# Altium project Elekid_Altium_Redo.PrjPcb
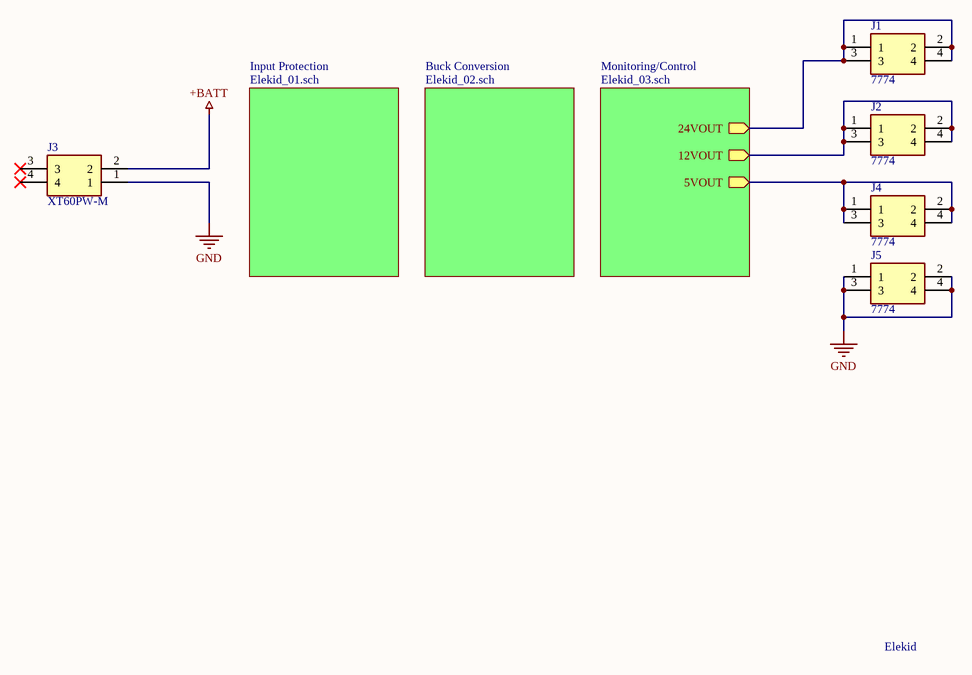
[diagram p0: Elekid.SchDoc]
5 sheets, 107 parts. Net scope: hierarchical (ports join the sheet entries above them; power ports are global).
Board file: Elekid.PcbDoc
Sheets:
  Elekid.SchDoc
  Elekid_01.SchDoc
  Elekid_02.SchDoc
  Elekid_03.SchDoc
    LED and LDO = Elekid_04.SchDoc

## Sheet Elekid.SchDoc
size A4

### Parts
J1  7774  [7774]
J2  7774  [7774]
J3  XT60PW-M  [XT60PWM]
J4  7774  [7774]
J5  7774  [7774]

### Sub-sheets
Buck Conversion = Elekid_02.sch (file not in this document): no entries
Input Protection = Elekid_01.sch (file not in this document): no entries
Monitoring/Control = Elekid_03.sch (file not in this document): 24VOUT (out), 12VOUT (out), 5VOUT (out)

### Nets
+BATT: J3.2
GND: J3.1 J5.1 J5.2 J5.3 J5.4
NetJ1_1: J1.1 J1.2 J1.3 J1.4 ; sheet Monitoring/Control/24VOUT
NetJ2_1: J2.1 J2.2 J2.3 J2.4 ; sheet Monitoring/Control/12VOUT
NetJ4_1: J4.1 J4.2 J4.3 J4.4 ; sheet Monitoring/Control/5VOUT

Not connected (* = marked no-connect by the designer): J3 3* 4*

### Notes on the sheet
- Elekid

### Library data of the parts
J1 J2 J4 J5 = 7774: Connector; Manufacturer_Name: Keystone Electronics; Datasheet Link: http://keyelco.com/userAssets/file/M65p66.pdf; Height: 4.6mm; Manufacturer_Part_Number: 7774; Arrow Part Number: 7774; Mouser Part Number: 534-7774; Mouser Price/Stock: https://www.mouser.co.uk/ProductDetail/Keystone-Electronics/7774?qs=%252B%252BPv0l39JAFc7pxogUYqRg%3D%3D
J3 = XT60PW-M: Connector; Manufacturer_Name: Changzou Amass Elec; Datasheet Link: https://www.tme.eu/Document/9b8d0c5eb7094295f3d3112c214d3ade/XT60PW%20SPEC.pdf; Height: 8.4mm; Manufacturer_Part_Number: XT60PW-M; Arrow Part Number: XT60PW-M

## Sheet Elekid_01.SchDoc
size A4
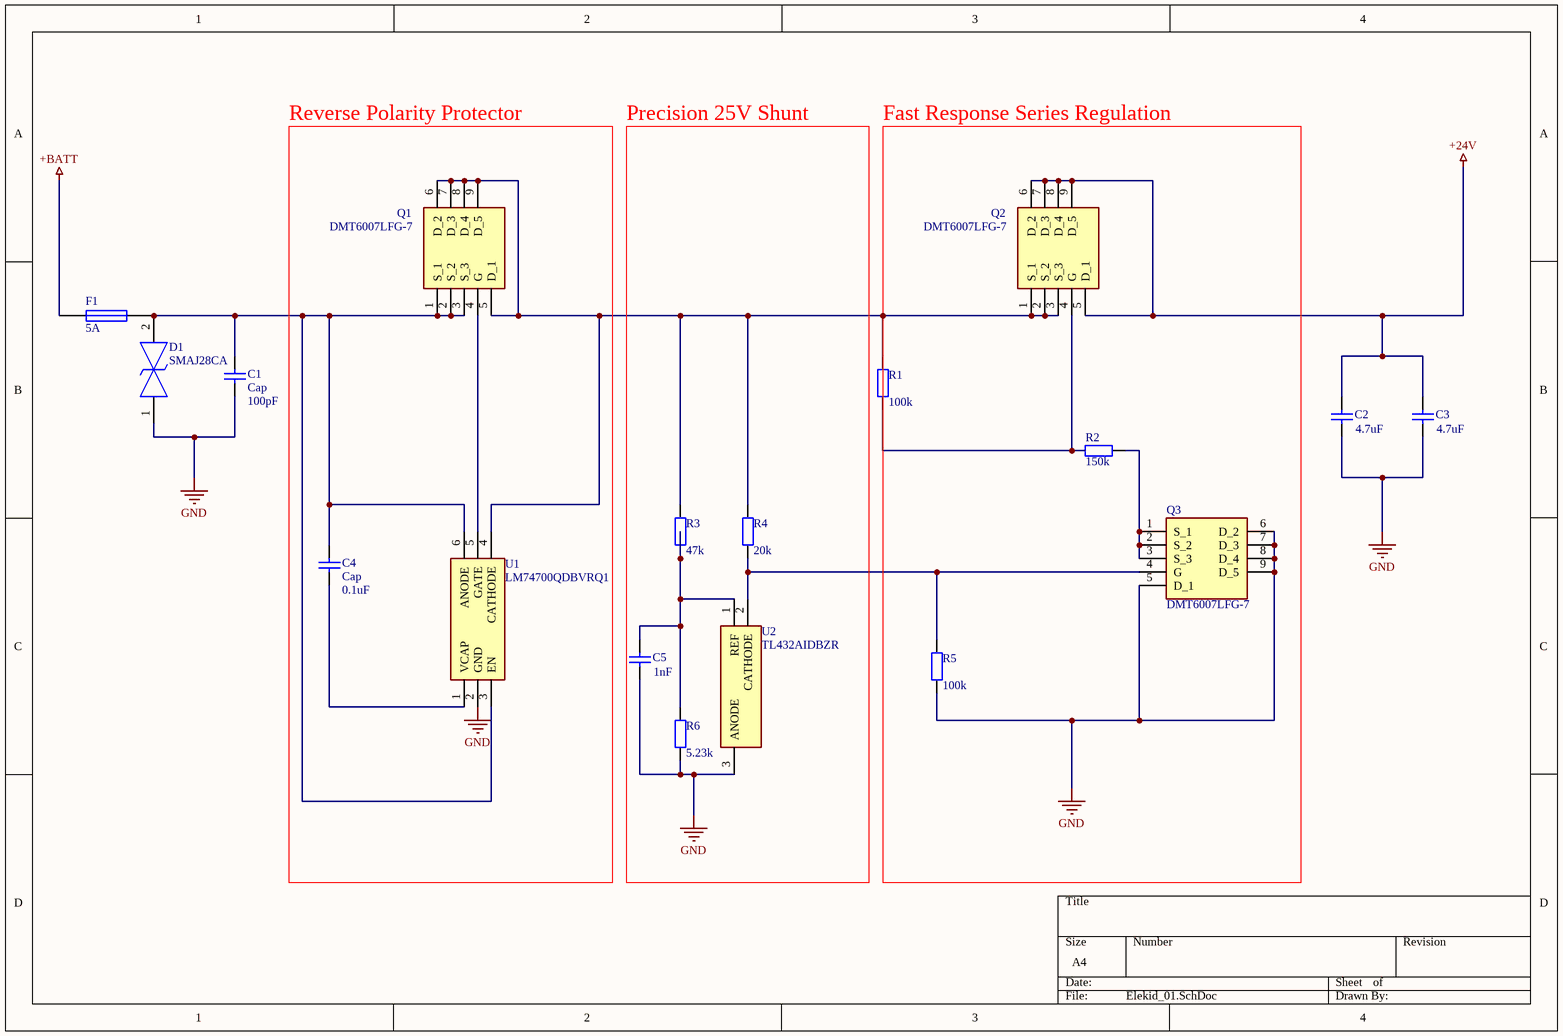
[diagram p1: Elekid_01.SchDoc]

### Parts
C1  Cap  value 100pF  [C0805]
C2  value 4.7uF  [C0805]  (hidden comment: Cap)
C3  value 4.7uF  [C0805]  (hidden comment: Cap)
C4  Cap  value 0.1uF  [C0805]
C5  value 1nF  [C0805]  (hidden comment: Cap)
D1  SMAJ28CA  [DIONM5226X262N]
F1  5A  [PIN-W2/E2.8]
Q1  DMT6007LFG-7  [DMT6007LFG7]
Q2  DMT6007LFG-7  [DMT6007LFG7]
Q3  DMT6007LFG-7  [DMT6007LFG7]
R1  value 100k  [C0805]  (hidden comment: Res2)
R2  value 150k  [C0805]  (hidden comment: Res2)
R3  value 47k  [C0805]  (hidden comment: Res2)
R4  value 20k  [C0805]  (hidden comment: Res2)
R5  value 100k  [C0805]  (hidden comment: Res2)
R6  value 5.23k  [C0805]  (hidden comment: Res2)
U1  LM74700QDBVRQ1  [SOT95P280X145-6N]
U2  TL432AIDBZR  [SOT95P237X112-3N]

### Blocks framed on the sheet
Reverse Polarity Protector: C4 Q1 U1
Precision 25V Shunt: C5 R3 R4 R6 U2
Fast Response Series Regulation: Q2 Q3 R1 R2 R5

### Nets
+24V: C2.2 C3.2 Q2.5(D_1) Q2.6(D_2) Q2.7(D_3) Q2.8(D_4) Q2.9(D_5)
+BATT: F1.1
GND: C1.1 C2.1 C3.1 C5.1 D1.1 Q3.5(D_1) Q3.6(D_2) Q3.7(D_3) Q3.8(D_4) Q3.9(D_5) R5.1 R6.1 U1.2(GND) U2.3(ANODE)
NetC1_2: C1.2 C4.2 D1.2 F1.2 Q1.1(S_1) Q1.2(S_2) Q1.3(S_3) U1.3(EN) U1.6(ANODE)
NetC4_1: C4.1 U1.1(VCAP)
NetC5_2: C5.2 R3.1 R6.2 U2.1(REF)
NetQ1_4: Q1.4(G) U1.5(GATE)
NetQ1_5: Q1.5(D_1) Q1.6(D_2) Q1.7(D_3) Q1.8(D_4) Q1.9(D_5) Q2.1(S_1) Q2.2(S_2) Q2.3(S_3) R1.2 R3.2 R4.2 U1.4(CATHODE)
NetQ2_4: Q2.4(G) R1.1 R2.2
NetQ3_1: Q3.1(S_1) Q3.2(S_2) Q3.3(S_3) R2.1
NetQ3_4: Q3.4(G) R4.1 R5.2 U2.2(CATHODE)

### Library data of the parts
C1-C5 = Cap: Capacitor; Published: 8-Jun-2000; LatestRevisionDate: 17-Jul-2002; LatestRevisionNote: Re-released for DXP Platform.; PackageReference: RAD-0.3; Publisher: Altium Limited; PackageDescription: Radial Cap, Thru-Hole; 2 Leads; 0.3 in Pin Spacing
D1 = SMAJ28CA: TVS Diode (Bi-directional); Manufacturer_Name: Bourns; Datasheet Link: https://www.bourns.com/data/global/pdfs/SMAJ.pdf; Height: 2.62mm; Manufacturer_Part_Number: SMAJ28CA; Arrow Part Number: SMAJ28CA; Arrow Price/Stock: https://www.arrow.com/en/products/smaj28ca/bourns; Mouser Part Number: 652-SMAJ28CA; Mouser Price/Stock: https://www.mouser.co.uk/ProductDetail/Bourns/SMAJ28CA?qs=A3H9pljuJ8Rc2FOBsYvsOw%3D%3D
F1 = Fuse 1: Fuse; Published: 8-Jun-2000; LatestRevisionDate: 17-Jul-2002; LatestRevisionNote: Re-released for DXP Platform.; PackageReference: PIN-W2/E2.8; Publisher: Altium Limited; PackageDescription: Thru-Hole; 2 Leads
Q1-Q3 = DMT6007LFG-7: MOSFET (N-Channel); Manufacturer_Name: Diodes Inc.; Datasheet Link: https://componentsearchengine.com/Datasheets/1/DMT6007LFG-7.pdf; Height: 0.85mm; Manufacturer_Part_Number: DMT6007LFG-7; Arrow Part Number: DMT6007LFG-7; Arrow Price/Stock: https://www.arrow.com/en/products/dmt6007lfg-7/diodes-incorporated; Mouser Part Number: 621-DMT6007LFG-7; Mouser Price/Stock: https://www.mouser.com/Search/Refine.aspx?Keyword=621-DMT6007LFG-7
R1-R6 = Res2: Resistor; Published: 8-Jun-2000; LatestRevisionDate: 17-Jul-2002; LatestRevisionNote: Re-released for DXP Platform.; PackageReference: AXIAL-0.4; Publisher: Altium Limited; PackageDescription: Axial Device, Thru-Hole; 2 Leads; 0.4 in Pin Spacing
U1 = LM74700QDBVRQ1: Integrated Circuit; Manufacturer_Name: Texas Instruments; Datasheet Link: http://www.ti.com/lit/gpn/LM74700-Q1; Height: 1.45mm; Manufacturer_Part_Number: LM74700QDBVRQ1; Arrow Part Number: LM74700QDBVRQ1; Arrow Price/Stock: https://www.arrow.com/en/products/lm74700qdbvrq1/texas-instruments; Mouser Part Number: 595-LM74700QDBVRQ1; Mouser Price/Stock: https://www.mouser.co.uk/ProductDetail/Texas-Instruments/LM74700QDBVRQ1?qs=j%252B1pi9TdxUYjAZhGV8eSkQ%3D%3D
U2 = TL432AIDBZR: Integrated Circuit; Manufacturer_Name: Texas Instruments; Datasheet Link: http://www.ti.com/lit/gpn/tl432a; Height: 1.12mm; Manufacturer_Part_Number: TL432AIDBZR; Arrow Part Number: TL432AIDBZR; Arrow Price/Stock: https://www.arrow.com/en/products/tl432aidbzr/texas-instruments; Mouser Part Number: 595-TL432AIDBZR; Mouser Price/Stock: https://www.mouser.co.uk/ProductDetail/Texas-Instruments/TL432AIDBZR?qs=odmYgEirbwzw%252BopYvrzCyA%3D%3D

## Sheet Elekid_02.SchDoc
size A4
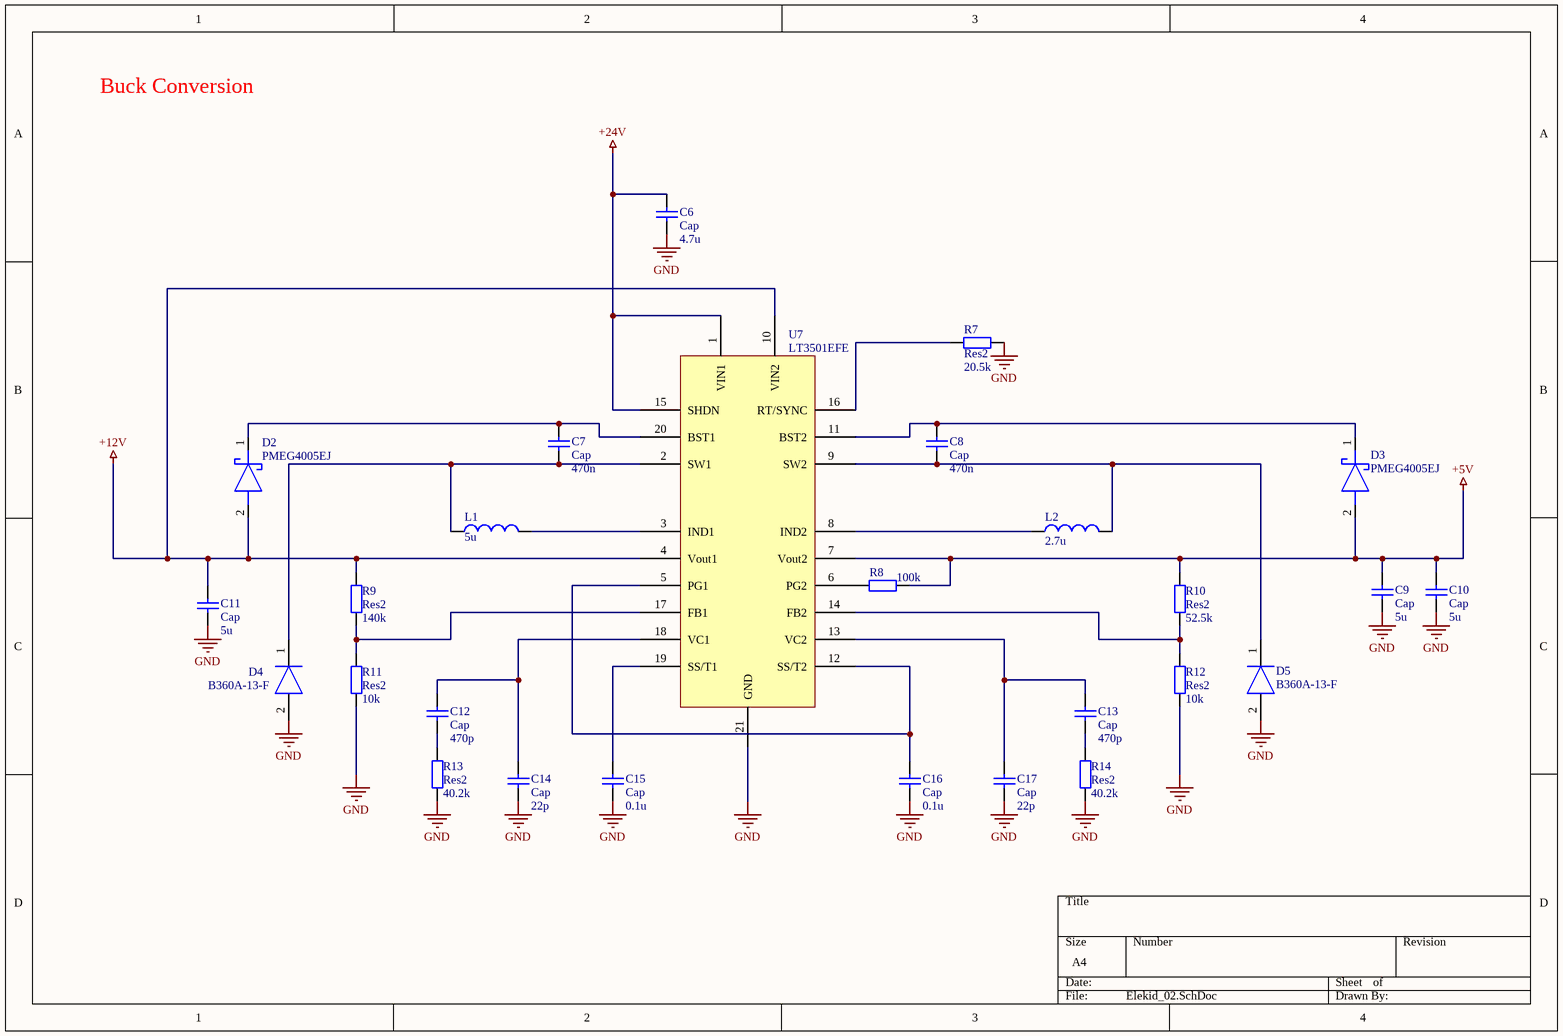
[diagram p2: Elekid_02.SchDoc]

### Parts
C6  Cap  value 4.7u  [C0805]
C7  Cap  value 470n  [C0805]
C8  Cap  value 470n  [C0805]
C9  Cap  value 5u  [C0805]
C10  Cap  value 5u  [C0805]
C11  Cap  value 5u  [C0805]
C12  Cap  value 470p  [C0805]
C13  Cap  value 470p  [C0805]
C14  Cap  value 22p  [C0805]
C15  Cap  value 0.1u  [C0805]
C16  Cap  value 0.1u  [C0805]
C17  Cap  value 22p  [C0805]
D2  PMEG4005EJ  [SOD2512X80N]
D3  PMEG4005EJ  [SOD2512X80N]
D4  B360A-13-F  [DIOM5226X240N]
D5  B360A-13-F  [DIOM5226X240N]
L1  value 5u  [c0805]  (hidden comment: Inductor)
L2  value 2.7u  [c0805]  (hidden comment: Inductor)
R7  Res2  value 20.5k  [C0805]
R8  value 100k  [C0805]  (hidden comment: Res2)
R9  Res2  value 140k  [C0805]
R10  Res2  value 52.5k  [C0805]
R11  Res2  value 10k  [C0805]
R12  Res2  value 10k  [C0805]
R13  Res2  value 40.2k  [C0805]
R14  Res2  value 40.2k  [C0805]
U7  LT3501EFE  [SOP65P640X120-21N]

### Nets
+5V: C9.2 C10.2 D3.2(A) R8.1 R10.2 U7.7(Vout2)
+12V: C11.2 D2.2(A) R9.2 U7.4(Vout1) U7.10(VIN2)
+24V: C6.2 U7.1(VIN1) U7.15(SHDN)
GND: C6.1 C9.1 C10.1 C11.1 C14.1 C15.1 C16.1 C17.1 D4.2(A) D5.2(A) R7.2 R11.1 R12.1 R13.1 R14.1 U7.21(GND)
NetC7_1: C7.1 D4.1(K) L1.1 U7.2(SW1)
NetC7_2: C7.2 D2.1(K) U7.20(BST1)
NetC8_1: C8.1 D5.1(K) L2.2 U7.9(SW2)
NetC8_2: C8.2 D3.1(K) U7.11(BST2)
NetC12_1: C12.1 R13.2
NetC12_2: C12.2 C14.2 U7.18(VC1)
NetC13_1: C13.1 R14.2
NetC13_2: C13.2 C17.2 U7.13(VC2)
NetC15_2: C15.2 U7.19(SS/T1)
NetC16_2: C16.2 U7.5(PG1) U7.12(SS/T2)
NetL1_2: L1.2 U7.3(IND1)
NetL2_1: L2.1 U7.8(IND2)
NetR7_1: R7.1 U7.16(RT/SYNC)
NetR8_2: R8.2 U7.6(PG2)
NetR9_1: R9.1 R11.2 U7.17(FB1)
NetR10_1: R10.1 R12.2 U7.14(FB2)

### Notes on the sheet
- Buck Conversion

### Library data of the parts
C6-C17 = Cap: Capacitor; Published: 8-Jun-2000; LatestRevisionDate: 17-Jul-2002; LatestRevisionNote: Re-released for DXP Platform.; PackageReference: RAD-0.3; Publisher: Altium Limited; PackageDescription: Radial Cap, Thru-Hole; 2 Leads; 0.3 in Pin Spacing
D2 D3 = PMEG4005EJ: Schottky Diode; Manufacturer_Name: Nexperia; Datasheet Link: http://www.nxp.com/documents/data_sheet/PMEGXX05EH_EJ_SER.pdf; Height: 0.8mm; Manufacturer_Part_Number: PMEG4005EJ; Arrow Part Number: PMEG4005EJ; Mouser Part Number: N/A; Mouser Price/Stock: https://www.mouser.com/Search/Refine.aspx?Keyword=N%2FA
D4 D5 = B360A-13-F: Diode; Manufacturer_Name: Diodes Inc.; Datasheet Link: https://www.diodes.com/assets/Datasheets/ds30891.pdf; Height: 2.4mm; Manufacturer_Part_Number: B360A-13-F; Arrow Part Number: B360A-13-F; Arrow Price/Stock: https://www.arrow.com/en/products/b360a-13-f/diodes-incorporated; Mouser Part Number: 621-B360A-F; Mouser Price/Stock: https://www.mouser.co.uk/ProductDetail/Diodes-Incorporated/B360A-13-F?qs=sVoUGXYOGv3xoCWNHVb4bA%3D%3D
L1 L2 = Inductor: Code_IEC: 1005; Published: 8-Jun-2000; LatestRevisionDate: 29-May-2009; LatestRevisionNote: IPC-7351 Footprint Added.; PackageReference: 0402-A; Publisher: Altium Limited; PackageDescription: Chip Inductor; Code_JEITA: 0402
R7-R14 = Res2: Resistor; Published: 8-Jun-2000; LatestRevisionDate: 17-Jul-2002; LatestRevisionNote: Re-released for DXP Platform.; PackageReference: AXIAL-0.4; Publisher: Altium Limited; PackageDescription: Axial Device, Thru-Hole; 2 Leads; 0.4 in Pin Spacing

## Sheet Elekid_03.SchDoc
size A4
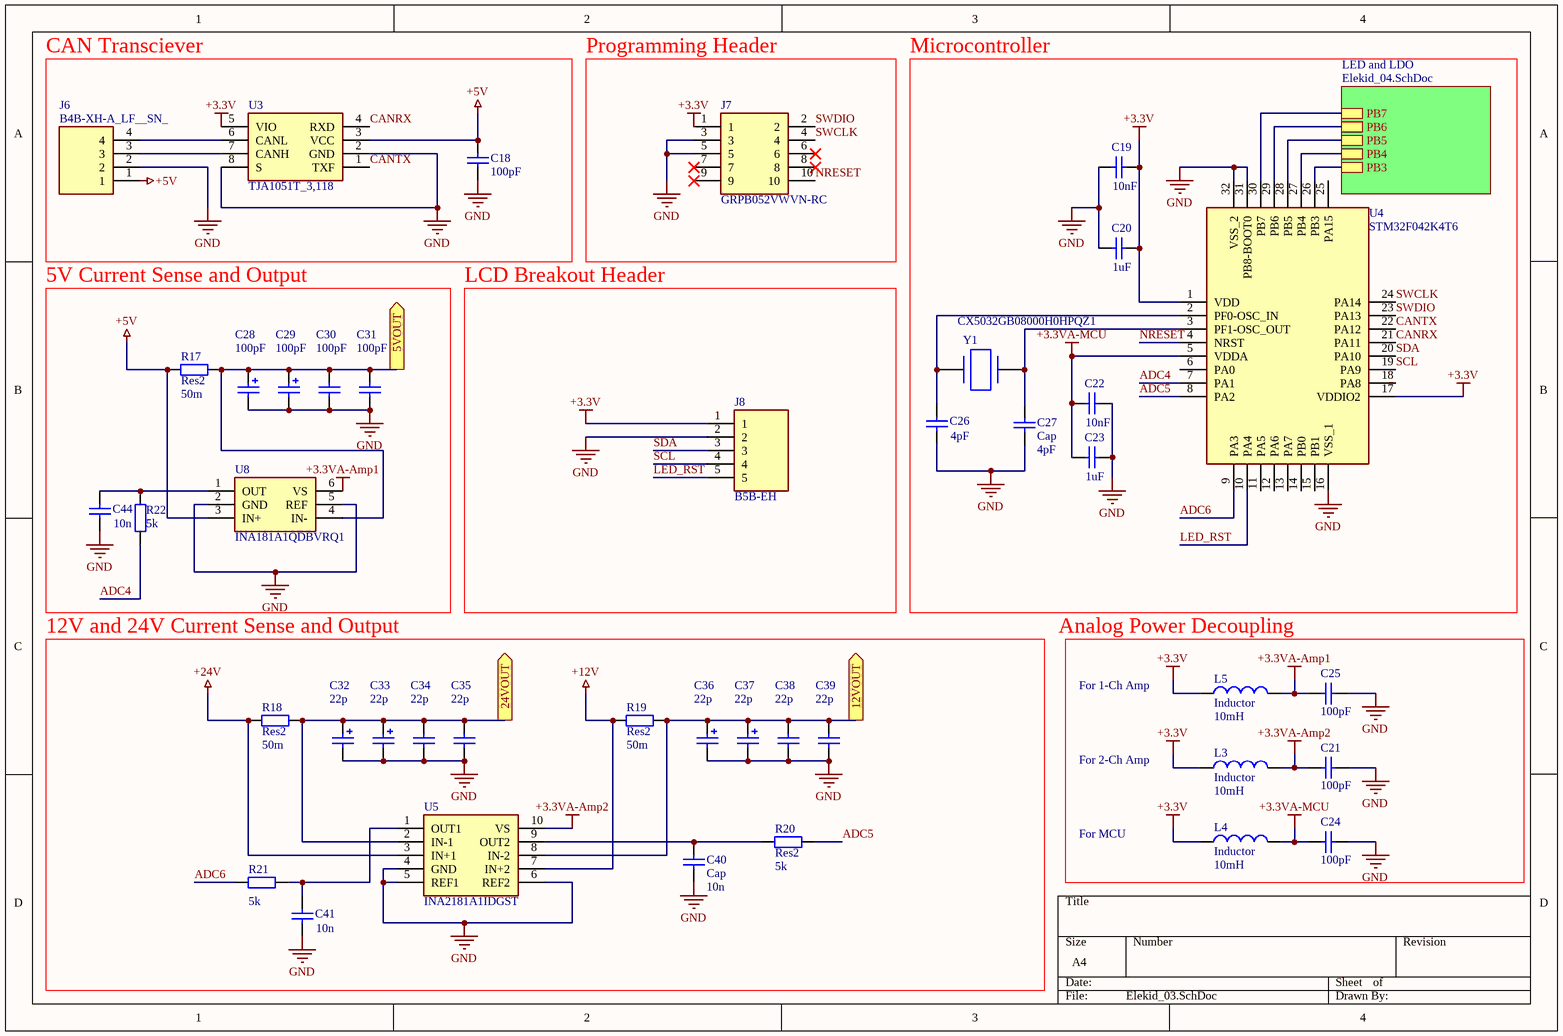
[diagram p3: Elekid_03.SchDoc]

### Parts
C18  value 100pF  [C0805]  (hidden comment: Cap)
C19  value 10nF  [C0805]  (hidden comment: Cap)
C20  value 1uF  [C0805]  (hidden comment: Cap)
C21  value 100pF  [C0805]  (hidden comment: Cap)
C22  value 10nF  [C0805]  (hidden comment: Cap)
C23  value 1uF  [C0805]  (hidden comment: Cap)
C24  value 100pF  [C0805]  (hidden comment: Cap)
C25  value 100pF  [C0805]  (hidden comment: Cap)
C26  value 4pF  [C0805]  (hidden comment: Cap)
C27  Cap  value 4pF  [C0805]
C28  value 100pF  [C0805]  (hidden comment: Cap Pol2)
C29  value 100pF  [C0805]  (hidden comment: Cap Pol2)
C30  value 100pF  [C0805]  (hidden comment: Cap)
C31  value 100pF  [C0805]  (hidden comment: Cap)
C32  value 22p  [C0805]  (hidden comment: Cap Pol2)
C33  value 22p  [C0805]  (hidden comment: Cap Pol2)
C34  value 22p  [C0805]  (hidden comment: Cap)
C35  value 22p  [C0805]  (hidden comment: Cap)
C36  value 22p  [C0805]  (hidden comment: Cap Pol2)
C37  value 22p  [C0805]  (hidden comment: Cap Pol2)
C38  value 22p  [C0805]  (hidden comment: Cap)
C39  value 22p  [C0805]  (hidden comment: Cap)
C40  Cap  value 10n  [C0805]
C41  value 10n  [C0805]  (hidden comment: Cap)
C44  value 10n  [C0805]  (hidden comment: Cap)
J6  B4B-XH-A_LF__SN_  [B4BXHALFSN]
J7  GRPB052VWVN-RC  [HDRV10W50P127_2X5_635X340X430P]
J8  B5B-EH  [SHDR5W64P0X250_1X5_1500X380X600P]
L3  Inductor  value 10mH  [c0805]
L4  Inductor  value 10mH  [c0805]
L5  Inductor  value 10mH  [c0805]
R17  Res2  value 50m  [C1206]
R18  Res2  value 50m  [C1206]
R19  Res2  value 50m  [C1206]
R20  Res2  value 5k  [C0805]
R21  value 5k  [C0805]  (hidden comment: Res2)
R22  value 5k  [C0805]  (hidden comment: Res2)
U3  TJA1051T_3,118  [SOIC127P600X175-8N]
U4  STM32F042K4T6  [QFP80P900X900X160-32N]
U5  INA2181A1IDGST  [SOP50P490X110-10N]
U8  INA181A1QDBVRQ1  [SOT95P280X145-6N]
Y1  CX5032GB08000H0HPQZ1  [CX5032GB08000H0HPQZ1]

### Blocks framed on the sheet
CAN Transciever: C18 J6 U3
Programming Header: J7
Microcontroller: C19 C20 C22 C23 C26 C27 U4 Y1
5V Current Sense and Output: C28-C31 C44 R17 R22 U8
LCD Breakout Header: J8
12V and 24V Current Sense and Output: C32-C41 R18-R21 U5

### Sub-sheets
LED and LDO = Elekid_04.SchDoc: PB7, PB6, PB5, PB4, PB3

### Ports
5VOUT (out), 12VOUT (out), 24VOUT (out)

### Nets
+3.3V: C19.1 C20.1 J7.1 J8.1 L3.1 L4.1 L5.1 U3.5(VIO) U4.1(VDD) U4.17(VDDIO2)
+3.3VA-Amp1: C25.1 L5.2 U8.6(VS)
+3.3VA-Amp2: C21.1 L3.2 U5.10(VS)
+3.3VA-MCU: C22.2 C23.2 C24.1 L4.2 U4.5(VDDA)
+5V: C18.2 J6.1 R17.1 U3.3(VCC) U8.3(IN+)
+12V: R19.1 U5.7(IN+2)
+24V: R18.1 U5.3(IN+1)
GND: C18.1 C19.2 C20.2 C21.2 C22.1 C23.1 C24.2 C25.2 C26.1 C27.1 C28.2 C29.2 C30.1 C31.1 C32.2 C33.2 C34.1 C35.1 C36.2 C37.2 C38.1 C39.1 C40.1 C41.1 C44.1 J6.2 J7.3 J7.5 J8.2 U3.2(GND) U3.8(S) U4.16(VSS_1) U4.31(PB8-BOOT0) U4.32(VSS_2) U5.4(GND) U5.5(REF1) U5.6(REF2) U8.2(GND) U8.5(REF)
ADC4: R22.1 U4.7(PA1)
ADC5: R20.2 U4.8(PA2)
ADC6: R21.1 U4.9(PA3)
CANRX: U3.4(RXD) U4.21(PA11)
CANTX: U3.1(TXF) U4.22(PA12)
LED_RST: J8.5 U4.10(PA4)
NRESET: J7.10 U4.4(NRST)
SCL: J8.4 U4.19(PA9)
SDA: J8.3 U4.20(PA10)
SWCLK: J7.4 U4.24(PA14)
SWDIO: J7.2 U4.23(PA13)
NetC26_2: C26.2 U4.2(PF0-OSC_IN) Y1.2
NetC27_2: C27.2 U4.3(PF1-OSC_OUT) Y1.1
NetC28_1: C28.1 C29.1 C30.2 C31.2 R17.2 U8.4(IN-) ; port 5VOUT
NetC32_1: C32.1 C33.1 C34.2 C35.2 R18.2 U5.2(IN-1) ; port 24VOUT
NetC36_1: C36.1 C37.1 C38.2 C39.2 R19.2 U5.8(IN-2) ; port 12VOUT
NetC40_2: C40.2 R20.1 U5.9(OUT2)
NetC41_2: C41.2 R21.2 U5.1(OUT1)
NetC44_2: C44.2 R22.2 U8.1(OUT)
NetD7_1: U4.30(PB7) ; sheet LED and LDO/PB7
NetD8_1: U4.29(PB6) ; sheet LED and LDO/PB6
NetD9_1: U4.28(PB5) ; sheet LED and LDO/PB5
NetD10_1: U4.27(PB4) ; sheet LED and LDO/PB4
NetD11_1: U4.26(PB3) ; sheet LED and LDO/PB3
NetJ6_3: J6.3 U3.7(CANH)
NetJ6_4: J6.4 U3.6(CANL)

Not connected (* = marked no-connect by the designer): J7 6* 7* 8* 9*; U4 6(PA0) 11(PA5) 12(PA6) 13(PA7) 14(PB0) 15(PB1) 18(PA8) 25(PA15)

### Notes on the sheet
- Analog Power Decoupling
- For 1-Ch Amp
- For 2-Ch Amp
- For MCU

### Library data of the parts
C18-C27 C30 C31 C34 C35 C38-C41 C44 = Cap: Capacitor; Published: 8-Jun-2000; LatestRevisionDate: 17-Jul-2002; LatestRevisionNote: Re-released for DXP Platform.; PackageReference: RAD-0.3; Publisher: Altium Limited; PackageDescription: Radial Cap, Thru-Hole; 2 Leads; 0.3 in Pin Spacing
C28 C29 C32 C33 C36 C37 = Cap Pol2: Polarized Capacitor (Axial); Published: 8-Jun-2000; LatestRevisionDate: 17-Jul-2002; LatestRevisionNote: Re-released for DXP Platform.; PackageReference: POLAR0.8; Publisher: Altium Limited; PackageDescription: Polarized Capacitor; 2 Leads
J6 = B4B-XH-A_LF__SN_: Connector; Manufacturer_Name: JST Sales America; Manufacturer_Part_Number: B4B-XH-A(LF)(SN); Datasheet Link: https://datasheet.lcsc.com/szlcsc/JST-Sales-America-B4B-XH-A-LF-SN_C144395.pdf; Height: 7mm; Arrow Part Number: B4B-XH-A(LF)(SN)
J7 = GRPB052VWVN-RC: Connector; Manufacturer_Name: Sullins; Datasheet Link: https://media.digikey.com/pdf/Data%20Sheets/Sullins%20PDFs/GRPB_%20_2VWVN-RC%2010954-C.pdf; Height: 4.3mm; Manufacturer_Part_Number: GRPB052VWVN-RC; Arrow Part Number: GRPB052VWVN-RC
J8 = B5B-EH: Connector; Manufacturer_Name: JST (JAPAN SOLDERLESS TERMINALS); Datasheet Link: http://www.jst-mfg.com/product/pdf/eng/eEH.pdf; Height: 6mm; Manufacturer_Part_Number: B5B-EH
L3-L5 = Inductor: Code_IEC: 1005; Published: 8-Jun-2000; LatestRevisionDate: 29-May-2009; LatestRevisionNote: IPC-7351 Footprint Added.; PackageReference: 0402-A; Publisher: Altium Limited; PackageDescription: Chip Inductor; Code_JEITA: 0402
R17-R22 = Res2: Resistor; Published: 8-Jun-2000; LatestRevisionDate: 17-Jul-2002; LatestRevisionNote: Re-released for DXP Platform.; PackageReference: AXIAL-0.4; Publisher: Altium Limited; PackageDescription: Axial Device, Thru-Hole; 2 Leads; 0.4 in Pin Spacing
U3 = TJA1051T_3,118: Integrated Circuit; Manufacturer_Name: NXP; Manufacturer_Part_Number: TJA1051T/3,118; Datasheet Link: http://www.nxp.com/docs/en/data-sheet/TJA1051.pdf; Height: 1.75mm; Arrow Part Number: TJA1051T/3,118; Arrow Price/Stock: https://www.arrow.com/en/products/tja1051t3118/nxp-semiconductors; Mouser Part Number: 771-TJA1051T3118; Mouser Price/Stock: https://www.mouser.co.uk/ProductDetail/NXP-Semiconductors/TJA1051T-3118?qs=O%2F7ihdSJpebv1PFlp05wnQ%3D%3D
U4 = STM32F042K4T6: Integrated Circuit; Manufacturer_Name: STMicroelectronics; Datasheet Link: https://www.mouser.com/datasheet/2/389/stm32f042c4-956225.pdf; Height: 1.6mm; Manufacturer_Part_Number: STM32F042K4T6; Arrow Part Number: STM32F042K4T6; Arrow Price/Stock: https://www.arrow.com/en/products/stm32f042k4t6/stmicroelectronics; Mouser Part Number: 511-STM32F042K4T6; Mouser Price/Stock: https://www.mouser.co.uk/ProductDetail/STMicroelectronics/STM32F042K4T6?qs=ClYTdQWm4hDAfZj5dd9NhA%3D%3D
U5 = INA2181A4IDGST: Integrated Circuit; Manufacturer_Name: Texas Instruments; Datasheet Link: http://www.ti.com/lit/ds/symlink/ina2181.pdf; Height: 1.1mm; Manufacturer_Part_Number: INA2181A4IDGST; Arrow Part Number: INA2181A4IDGST; Arrow Price/Stock: https://www.arrow.com/en/products/ina2181a4idgst/texas-instruments; Mouser Part Number: 595-INA2181A4IDGST; Mouser Price/Stock: https://www.mouser.co.uk/ProductDetail/Texas-Instruments/INA2181A4IDGST?qs=j%252B1pi9TdxUbPFaAVw1%2FxVg%3D%3D
U8 = INA181A1QDBVRQ1: Integrated Circuit; Manufacturer_Name: Texas Instruments; Datasheet Link: http://www.ti.com/lit/gpn/INA181-Q1; Height: 1.45mm; Manufacturer_Part_Number: INA181A1QDBVRQ1; Arrow Part Number: INA181A1QDBVRQ1; Arrow Price/Stock: https://www.arrow.com/en/products/ina181a1qdbvrq1/texas-instruments; Mouser Part Number: 595-INA181A1QDBVRQ1; Mouser Price/Stock: https://www.mouser.co.uk/ProductDetail/Texas-Instruments/INA181A1QDBVRQ1?qs=EBDBlbfErPx7yYU5sEtaJQ%3D%3D
Y1 = CX5032GB08000H0HPQZ1: Crystal or Oscillator; Manufacturer_Name: Kyocera Electronic Components; Datasheet Link: https://media.digikey.com/pdf/Data%20Sheets/AVX%20PDFs/CX5032GB0yyyyyH0HPQZ1_Series_Spec.pdf; Height: 1.1mm; Manufacturer_Part_Number: CX5032GB08000H0HPQZ1; Arrow Part Number: CX5032GB08000H0HPQZ1; Mouser Part Number: 581-CX532GB8HHPQZ1; Mouser Price/Stock: https://www.mouser.co.uk/ProductDetail/Kyocera-Electronic-Components/CX5032GB08000H0HPQZ1?qs=mFMVSnANsC2SO%252B6cjFFj8w%3D%3D

## Sheet Elekid_04.SchDoc
size A4
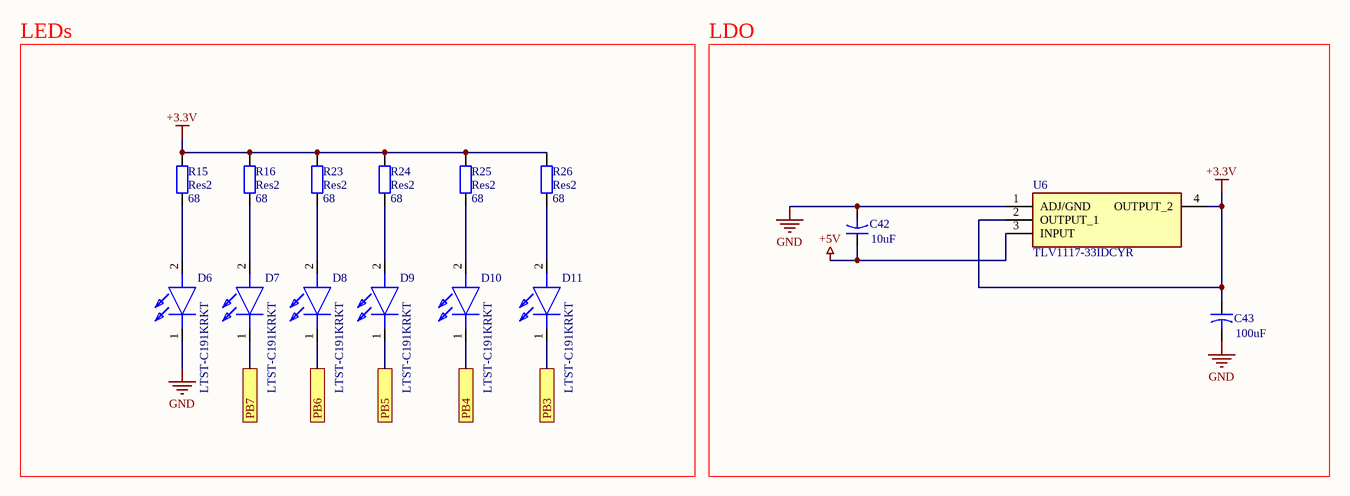
[diagram p4: Elekid_04.SchDoc]

### Parts
C42  value 10uF  [C0805]  (hidden comment: Cap2)
C43  value 100uF  [C0805]  (hidden comment: Cap2)
D6  LTST-C191KRKT  [LEDC1608X55N]
D7  LTST-C191KRKT  [LEDC1608X55N]
D8  LTST-C191KRKT  [LEDC1608X55N]
D9  LTST-C191KRKT  [LEDC1608X55N]
D10  LTST-C191KRKT  [LEDC1608X55N]
D11  LTST-C191KRKT  [LEDC1608X55N]
R15  Res2  value 68  [C0805]
R16  Res2  value 68  [C0805]
R23  Res2  value 68  [C0805]
R24  Res2  value 68  [C0805]
R25  Res2  value 68  [C0805]
R26  Res2  value 68  [C0805]
U6  TLV1117-33IDCYR  [SOT230P700X180-4N]

### Blocks framed on the sheet
LEDs: D6-D11 R15 R16 R23-R26
LDO: C42 C43 U6

### Ports
PB3, PB4, PB5, PB6, PB7

### Nets
+3.3V: C43.1 R15.2 R16.2 R23.2 R24.2 R25.2 R26.2 U6.2(OUTPUT_1) U6.4(OUTPUT_2)
+5V: C42.1 U6.3(INPUT)
GND: C42.2 C43.2 D6.1(K) U6.1(ADJ/GND)
NetD6_2: D6.2(A) R15.1
NetD7_1: D7.1(K) ; port PB7
NetD7_2: D7.2(A) R16.1
NetD8_1: D8.1(K) ; port PB6
NetD8_2: D8.2(A) R23.1
NetD9_1: D9.1(K) ; port PB5
NetD9_2: D9.2(A) R24.1
NetD10_1: D10.1(K) ; port PB4
NetD10_2: D10.2(A) R25.1
NetD11_1: D11.1(K) ; port PB3
NetD11_2: D11.2(A) R26.1

### Library data of the parts
C42 C43 = Cap2: Capacitor; Published: 23-Sep-2002; PackageReference: CAPR5-4X5; Publisher: Altium Limited; PackageDescription: Capacitor; 2 Leads
D6-D11 = LTST-C191KRKT: LED; Manufacturer_Name: Lite-On; Datasheet Link: http://www.mouser.com/ds/2/239/S_110_LTST-C191KRKT-539838.pdf; Height: 0.55mm; Manufacturer_Part_Number: LTST-C191KRKT; Arrow Part Number: LTST-C191KRKT; Arrow Price/Stock: https://www.arrow.com/en/products/ltst-c191krkt/lite-on-technology; Mouser Part Number: 859-LTST-C191KRKT; Mouser Price/Stock: https://www.mouser.co.uk/ProductDetail/Lite-On/LTST-C191KRKT?qs=BAIUz4Y8PJBLfOhzue0q%252BA%3D%3D
R15 R16 R23-R26 = Res2: Resistor; Published: 8-Jun-2000; LatestRevisionDate: 17-Jul-2002; LatestRevisionNote: Re-released for DXP Platform.; PackageReference: AXIAL-0.4; Publisher: Altium Limited; PackageDescription: Axial Device, Thru-Hole; 2 Leads; 0.4 in Pin Spacing
U6 = TLV1117-33CDCYR: Integrated Circuit; Manufacturer_Name: Texas Instruments; Datasheet Link: http://www.ti.com/lit/gpn/tlv1117; Height: 1.8mm; Manufacturer_Part_Number: TLV1117-33CDCYR; Arrow Part Number: TLV1117-33CDCYR; Arrow Price/Stock: https://www.arrow.com/en/products/tlv1117-33cdcyr/texas-instruments; Mouser Part Number: 595-TLV1117-33CDCYR; Mouser Price/Stock: https://www.mouser.co.uk/ProductDetail/Texas-Instruments/TLV1117-33CDCYR?qs=p6lVfQR1GSoiRKz8KGIbKg%3D%3D

## Nets that join several sheets
+3.3V: Elekid_03 (10 pins), Elekid_04 (9 pins)
+5V: Elekid_02 (6 pins), Elekid_03 (5 pins), Elekid_04 (C42.1 U6.3)
+12V: Elekid_02 (5 pins), Elekid_03 (R19.1 U5.7)
+24V: Elekid_01 (7 pins), Elekid_02 (C6.2 U7.1 U7.15), Elekid_03 (R18.1 U5.3)
+BATT: Elekid (J3.2), Elekid_01 (F1.1)
GND: Elekid (5 pins), Elekid_01 (14 pins), Elekid_02 (16 pins), Elekid_03 (39 pins), Elekid_04 (C42.2 C43.2 D6.1 U6.1)
NetD7_1: Elekid_03 (U4.30), Elekid_04 (D7.1)
NetD8_1: Elekid_03 (U4.29), Elekid_04 (D8.1)
NetD9_1: Elekid_03 (U4.28), Elekid_04 (D9.1)
NetD10_1: Elekid_03 (U4.27), Elekid_04 (D10.1)
NetD11_1: Elekid_03 (U4.26), Elekid_04 (D11.1)